# Altium schematic sheet Sonar.SchDoc
size A3; SheetNumber: 1; SheetTotal: 1
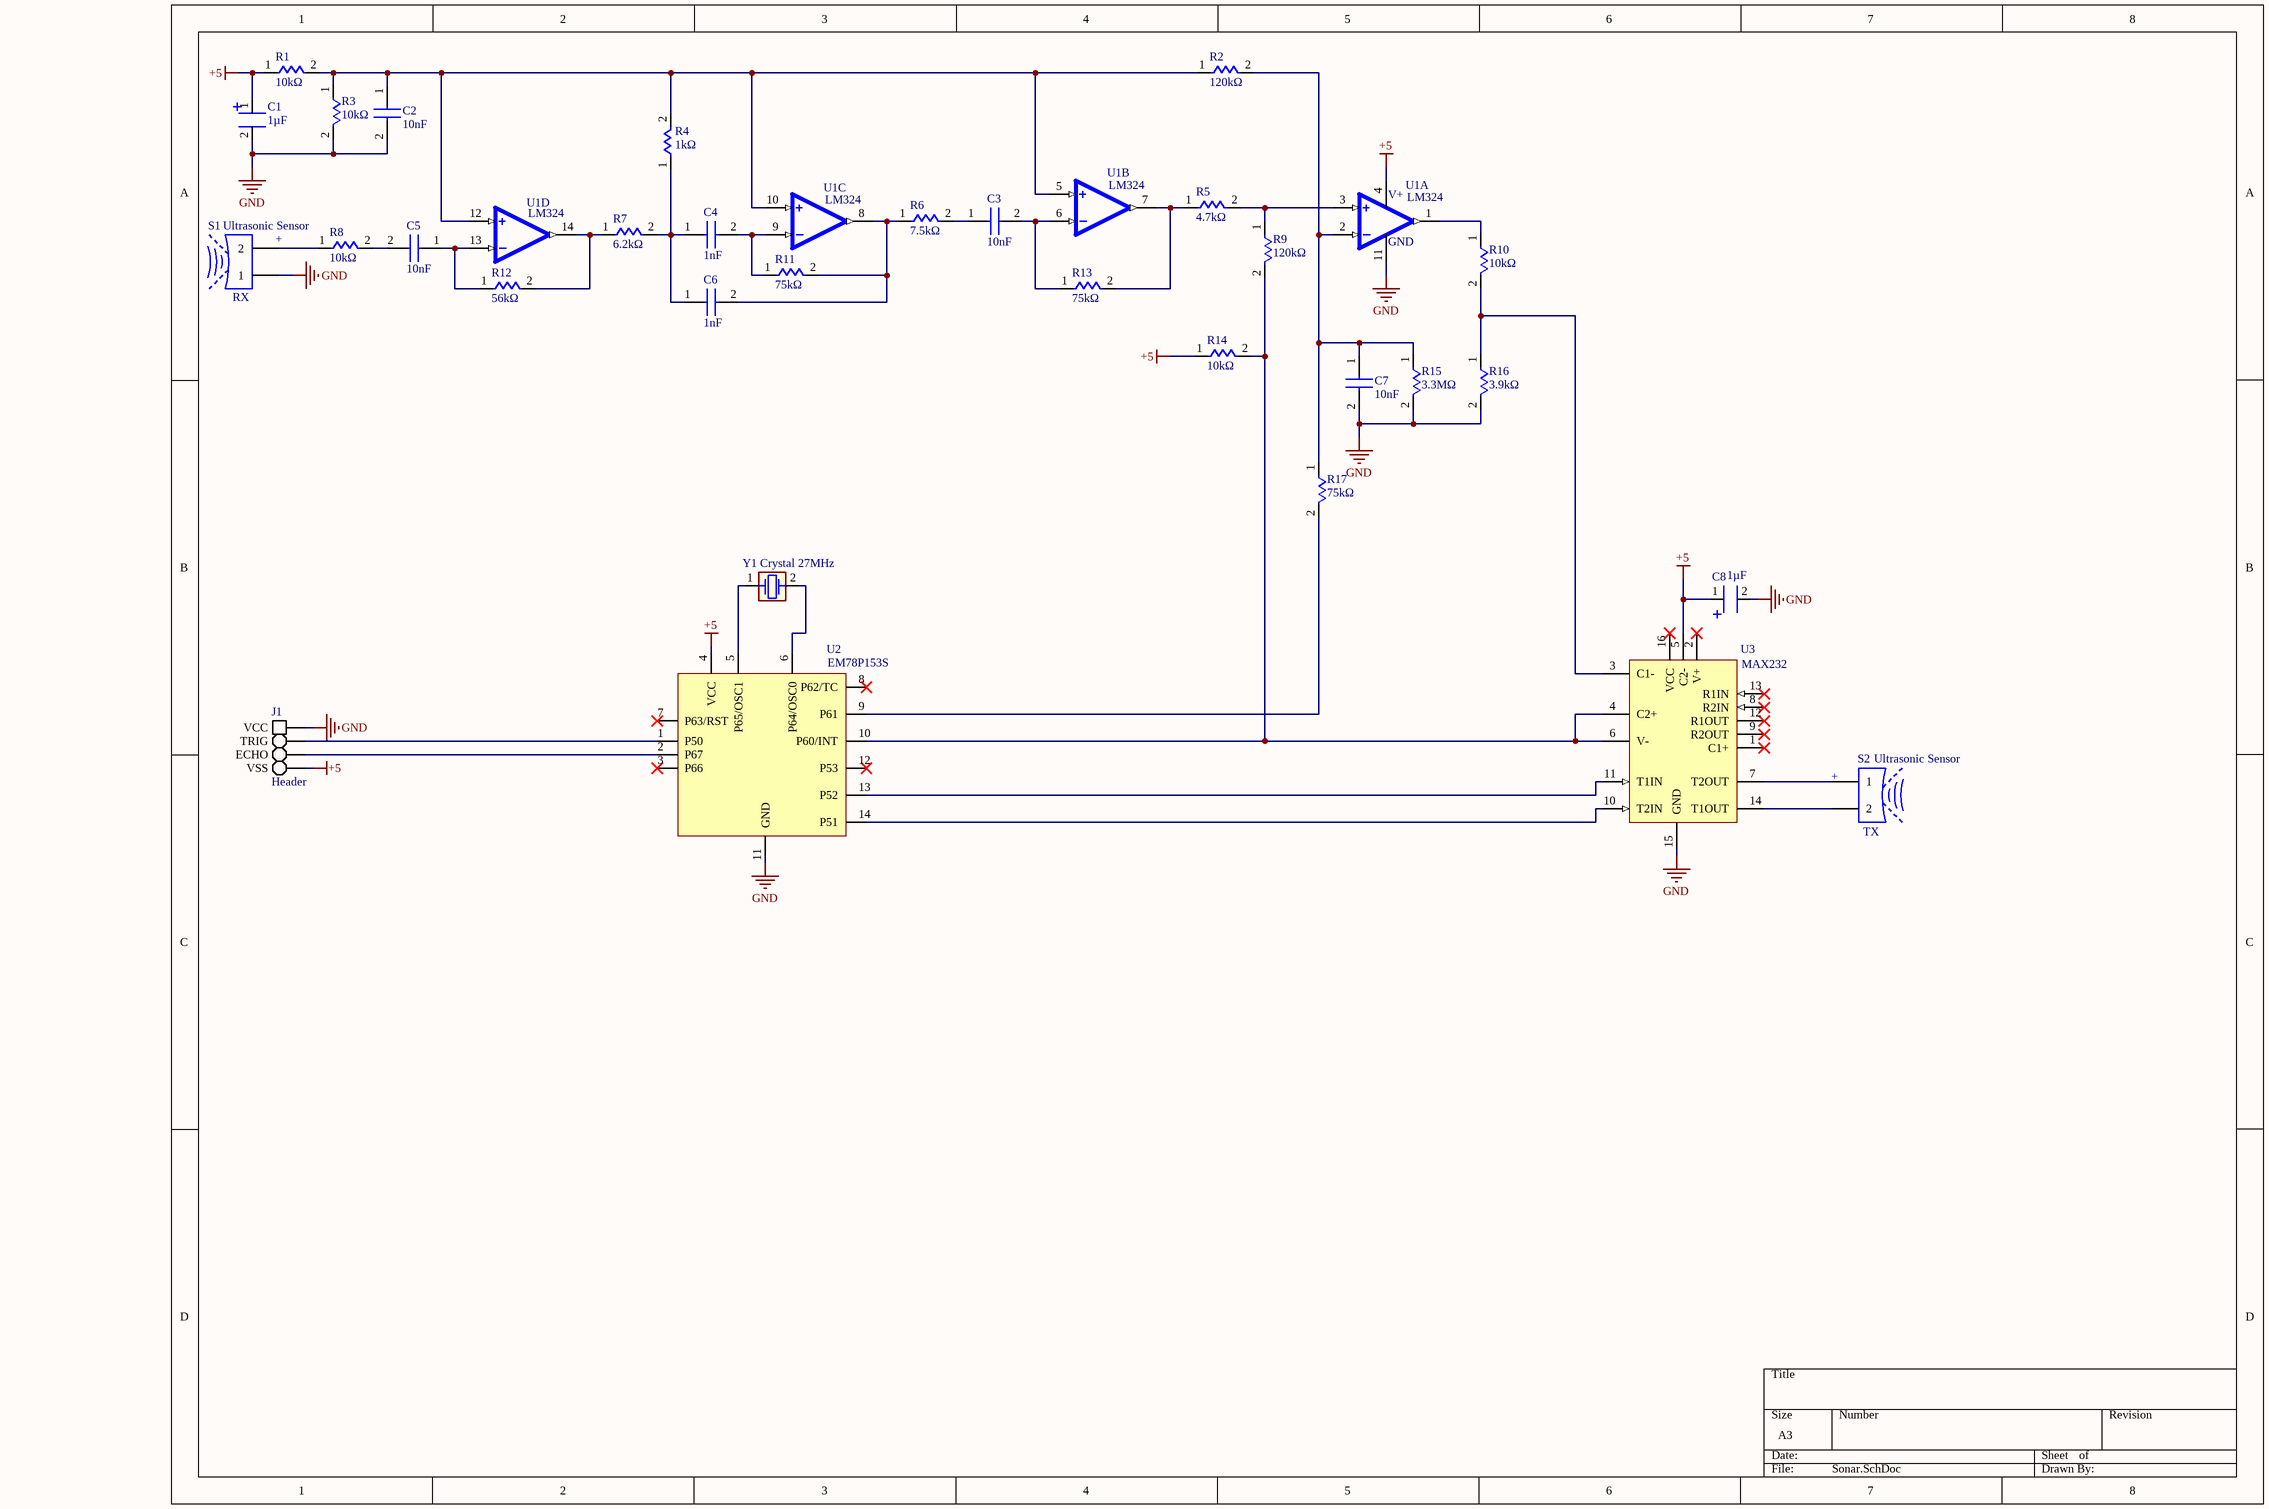
[diagram p0: Sonar.SchDoc]

## Parts
C1  1µF  [CAP.EL.]
C2  10nF  [CAP]
C3  10nF  [CAP]
C4  1nF  [CAP]
C5  10nF  [CAP]
C6  1nF  [CAP]
C7  10nF  [CAP]
C8  1µF  [CAP.EL.]
J1  Header  [Header 1x4]
R1  10kΩ  [THT Res]
R2  120kΩ  [THT Res]
R3  10kΩ  [THT Res]
R4  1kΩ  [THT Res]
R5  4.7kΩ  [THT Res]
R6  7.5kΩ  [THT Res]
R7  6.2kΩ  [THT Res]
R8  10kΩ  [THT Res]
R9  120kΩ  [THT Res]
R10  10kΩ  [THT Res]
R11  75kΩ  [THT Res]
R12  56kΩ  [THT Res]
R13  75kΩ  [THT Res]
R14  10kΩ  [THT Res]
R15  3.3MΩ  [THT Res]
R16  3.9kΩ  [THT Res]
R17  75kΩ  [THT Res]
S1  Ultrasonic Sensor  [Ultrasonic Sensor]
S2  Ultrasonic Sensor  [Ultrasonic Sensor]
U1  LM324  [LM324]  (parts A,B,C,D of 4)
U2  EM78P153S  [EM78P153S]
U3  MAX232  [MAX232]
Y1  Crystal 27MHz  [Crsytal]

## Nets
+5: C1.1 C8.1 J1.4(VSS) R1.1 R14.1 U1.4(V+) U2.4(VCC) U3.5(C2-)
GND: C1.2 C2.2 C7.2 C8.2 J1.1(VCC) R3.2 R15.2 R16.2 S1.1 U1.11(GND) U2.11(GND) U3.15(GND)
NetC2_1: C2.1 R1.2 R2.1 R3.1 R4.2 U1.5(2IN+) U1.10(3IN+) U1.12(4IN+)
NetC3_1: C3.1 R6.2
NetC3_2: C3.2 R13.1 U1.6(2IN-)
NetC4_1: C4.1 C6.1 R4.1 R7.2
NetC4_2: C4.2 R11.1 U1.9(3IN-)
NetC5_1: C5.1 R12.1 U1.13(4IN-)
NetC5_2: C5.2 R8.2
NetC6_2: C6.2 R6.1 R11.2 U1.8(3OUT)
NetC7_1: C7.1 R2.2 R15.1 R17.1 U1.2(1IN-)
NetJ1_2: J1.2(TRIG) U2.1(P50)
NetJ1_3: J1.3(ECHO) U2.2(P67)
NetR5_1: R5.1 R13.2 U1.7(2OUT)
NetR5_2: R5.2 R9.1 U1.3(1IN+)
NetR7_1: R7.1 R12.2 U1.14(4OUT)
NetR8_1: R8.1 S1.2
NetR9_2: R9.2 R14.2 U2.10(P60/INT) U3.4(C2+) U3.6(V-)
NetR10_1: R10.1 U1.1(1OUT)
NetR10_2: R10.2 R16.1 U3.3(C1-)
NetR17_2: R17.2 U2.9(P61)
NetS2_1: S2.1 U3.7(T2OUT)
NetS2_2: S2.2 U3.14(T1OUT)
NetU2_5: U2.5(P65/OSC1) Y1.1
NetU2_6: U2.6(P64/OSC0) Y1.2
NetU2_13: U2.13(P52) U3.11(T1IN)
NetU2_14: U2.14(P51) U3.10(T2IN)

Not connected (* = marked no-connect by the designer): U2 3(P66)* 7(P63/RST)* 8(P62/TC)* 12(P53)*; U3 1(C1+)* 2(V+)* 8(R2IN)* 9(R2OUT)* 12(R1OUT)* 13(R1IN)* 16(VCC)*

## Notes on the sheet
- (near S1) +
- (near S1) RX
- (near S2) +
- (near S2) TX

## Library data of the parts
C1 C8 = Cap Pol: MZ1V687M12020PH - CAP.EL.680uF 35V 12.5x20 5MM 105C TB SAMWHA; ComponentLink1Description: Satın Alma Linki; ComponentLink1URL: https://www.robotistan.com/50v-1-uf-kondansator; ComponentLink2Description: Datasheet; ComponentLink2URL: https://www.jameco.com/Jameco/Products/ProdDS/29831.pdf
C2-C7 = CAP: Capacitor; ComponentLink1Description: Satın Alma Linki; ComponentLink1URL: https://www.robotistan.com/10nf-seramik-kondansator-paketi-10-adet; ComponentLink2Description: Satın Alma Linki; ComponentLink2URL: https://www.robotistan.com/1nf-seramik-kondansator-paketi-10-adet
R1-R17 = THT RES: ComponentLink1Description: Satın Alma Linki; ComponentLink1URL: https://www.robotistan.com/14w-10k-direnc-paketi-10-adet; ComponentLink2Description: Satın Alma Linki; ComponentLink2URL: https://www.robotistan.com/14w-56k-direnc-paketi-10-adet; ComponentLink3Description: Satın Alma Linki; ComponentLink3URL: https://www.robotistan.com/14w-1k-direnc-paketi-10-adet; ComponentLink4Description: Satın Alma Linki; ComponentLink4URL: https://www.robomarket.com.tr/6-2k-direnc-1-adet-1-4w; ComponentLink5Description: Satın Alma Linki; ComponentLink5URL: https://www.robotistan.com/12w-75k-10-adet; ComponentLink6Description: Satın Alma Linki; ComponentLink6URL: https://www.direnc.net/75k-14w-metalfilm-direnc-paketi-100-adet-1?language=tr&h=cb2d2062; ComponentLink7Description: Satın Alma Linki; ComponentLink7URL: https://www.robotistan.com/14w-4k7-direnc-paketi-10-adet; ComponentLink8Description: Satın Alma Linki; ComponentLink8URL: https://www.robotistan.com/2w-120k; ComponentLink9Description: Satın Alma Linki; ComponentLink9URL: https://www.robotistan.com/14w-3k9-direnc-paketi-10-adet?language=tr&h=0f40f5ee&gclid=CjwKCAjwxOCRBhA8EiwA0X8hi8jDuTXAWIdHih4LhQcB3YXTjEJ8OgB0uW3rlfstCae65K6p5gflnBoC2EgQAvD_BwE; ComponentLink10Description: Satın Alma Linki; ComponentLink10URL: https://www.motorobit.com/urun/3-3m-1-4w-direnc-10-adet
U1 = LM324N/NOPB: 4-Channel industry standard operational amplifier 14-PDIP 0 to 70; MP: LM324N; MF: Texas Instruments; Purchase-URL: https://pricing.snapeda.com/search/part/LM324N/?ref=eda; Package: PDIP-14 Texas Instruments; Price: None; Value: *; Availability: Good; Check_prices: https://www.snapeda.com/parts/LM324N/Texas%20Instruments/view-part/295/?ref=eda; SnapEDA_Link: https://www.snapeda.com/parts/LM324N/Texas%20Instruments/view-part/295/?ref=snap; ComponentLink1Description: Satın Alma Linki; ComponentLink1URL: https://www.robotistan.com/lm324-dip14?language=tr&h=409e2aff&gclid=CjwKCAjwxOCRBhA8EiwA0X8hiwXGgK4v1rrybFC684ThaUQRfGP744yHBnQdMK1VYz9g8hevPAV6yhoCZSUQAvD_BwE; ComponentLink2Description: Datasheet; ComponentLink2URL: https://www.ti.com/lit/ds/symlink/lm124-n.pdf
U3 = MAX232: Multichannel RS-232 Driver/Receiver, 5 V, 0 to 70 degC, 16-Pin SOIC (S16+3), RoHS, Tube; Manufacturer: Maxim; Package Version: Rev. G, 01/2016; Min Supply Voltage: 4.5V; Max Supply Voltage: 5.5V; Receivers: 2; Propagation Delay: 10us; Nominal Supply Current: 10mA; Data Rate: 120Kbps; Nominal Supply Voltage: 5V; Package URL: http://pdfserv.maximintegrated.com/package_dwgs/21-0041.PDF; Min Operating Temperature: 0°C; Datasheet URL: https://datasheets.maximintegrated.com/en/ds/MAX220-MAX249.pdf; Package Quantity: 50; Case/Package: SOIC; Package Description: 16-Pin Small Outline Integrated Circuit, Body 9.9 x 3.9 mm, Pitch 1.27 mm; Package Reference: S16+5; Interface: RS-232; Pins: 16; Manufacturer URL: http://www.maximintegrated.com/; Channels: 2; RoHS Compliant: True; Mounting Technology: SM; Packaging: Rail/Tube; Max Operating Temperature: 70°C; Datasheet Version: Rev. 17, 01/2015; ComponentLink1Description: Satın Alma Linki; ComponentLink1URL: https://www.robotistan.com/max232-dip16; ComponentLink2Description: Datasheet; ComponentLink2URL: https://datasheets.maximintegrated.com/en/ds/MAX220-MAX249.pdf
Y1 = Crystal: 27.000 MHz Kristal HC-49S; ComponentLink1Description: Satın Alma Linki; ComponentLink1URL: https://www.direnc.net/27000-mhz-kristal-hc-49s-50; ComponentLink2Description: Datasheet; ComponentLink2URL: https://www.newteck-ci.com.br/datasheet/20140520084905.pdf
J1 = Header: ComponentLink3Description: Satın Alma Linki; ComponentLink3URL: https://www.robotistan.com/1x40-180-12mm
S1 S2 = Ultrasonic Sensor: ComponentLink1Description: Satın Alma Linki; ComponentLink1URL: https://www.robotistan.com/suya-dayanikli-ultrasonik-sensor-10mm?language=tr&h=b3c9ab81; ComponentLink2Description: Satın Alma Linki; ComponentLink2URL: https://www.robotistan.com/rt40k-ultrasonik-sensor-16mm; ComponentLink3Description: Datasheet; ComponentLink3URL: https://tr.aliexpress.com/item/33039788263.html?spm=a2g0o.productlist.0.0.66bc1f47oNyabD&algo_pvid=28f77d51-3c5b-4650-aee5-95afa2ae2236&algo_exp_id=28f77d51-3c5b-4650-aee5-95afa2ae2236-42&pdp_ext_f=%7B%22sku_id%22%3A%2267411356863%22%7D&pdp_pi=-1%3B17.15%3B-1%3B-1%40salePrice%3BTRY%3Bsearch-mainSearch
U2 = EM78P153S: ComponentLink1Description: Satın Alma Linki; ComponentLink1URL: *; ComponentLink2Description: Datasheet; ComponentLink2URL: http://www.agspecinfo.com/pdfs/E/EM78P153.PDF